# Altium schematic sheet USB_HUB2 DN PORT.SchDoc: USB_HUB 3.0
size A2; DrawnBy: Luca Schenetti; Revision: A; SheetNumber: 8; SheetTotal: 10
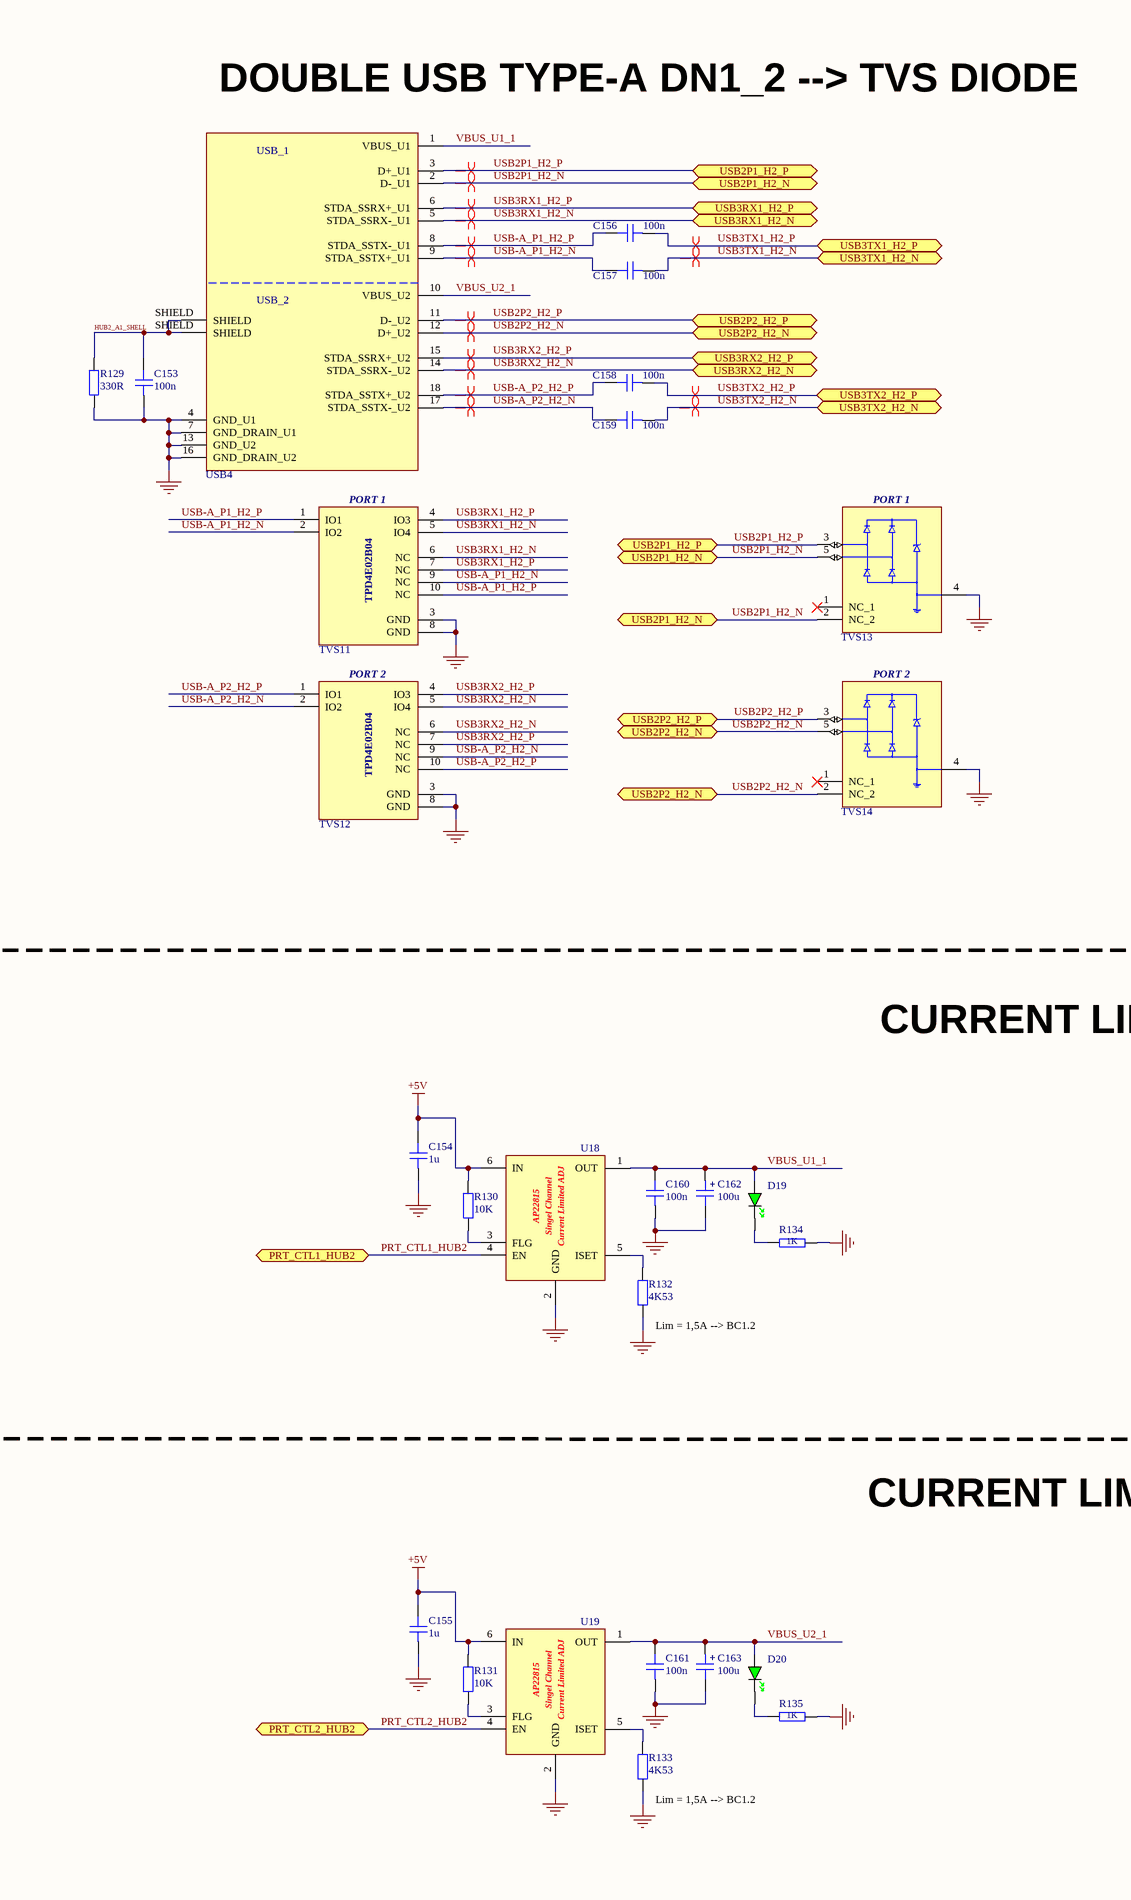
[diagram p0: USB_HUB2 DN PORT.SchDoc, left]
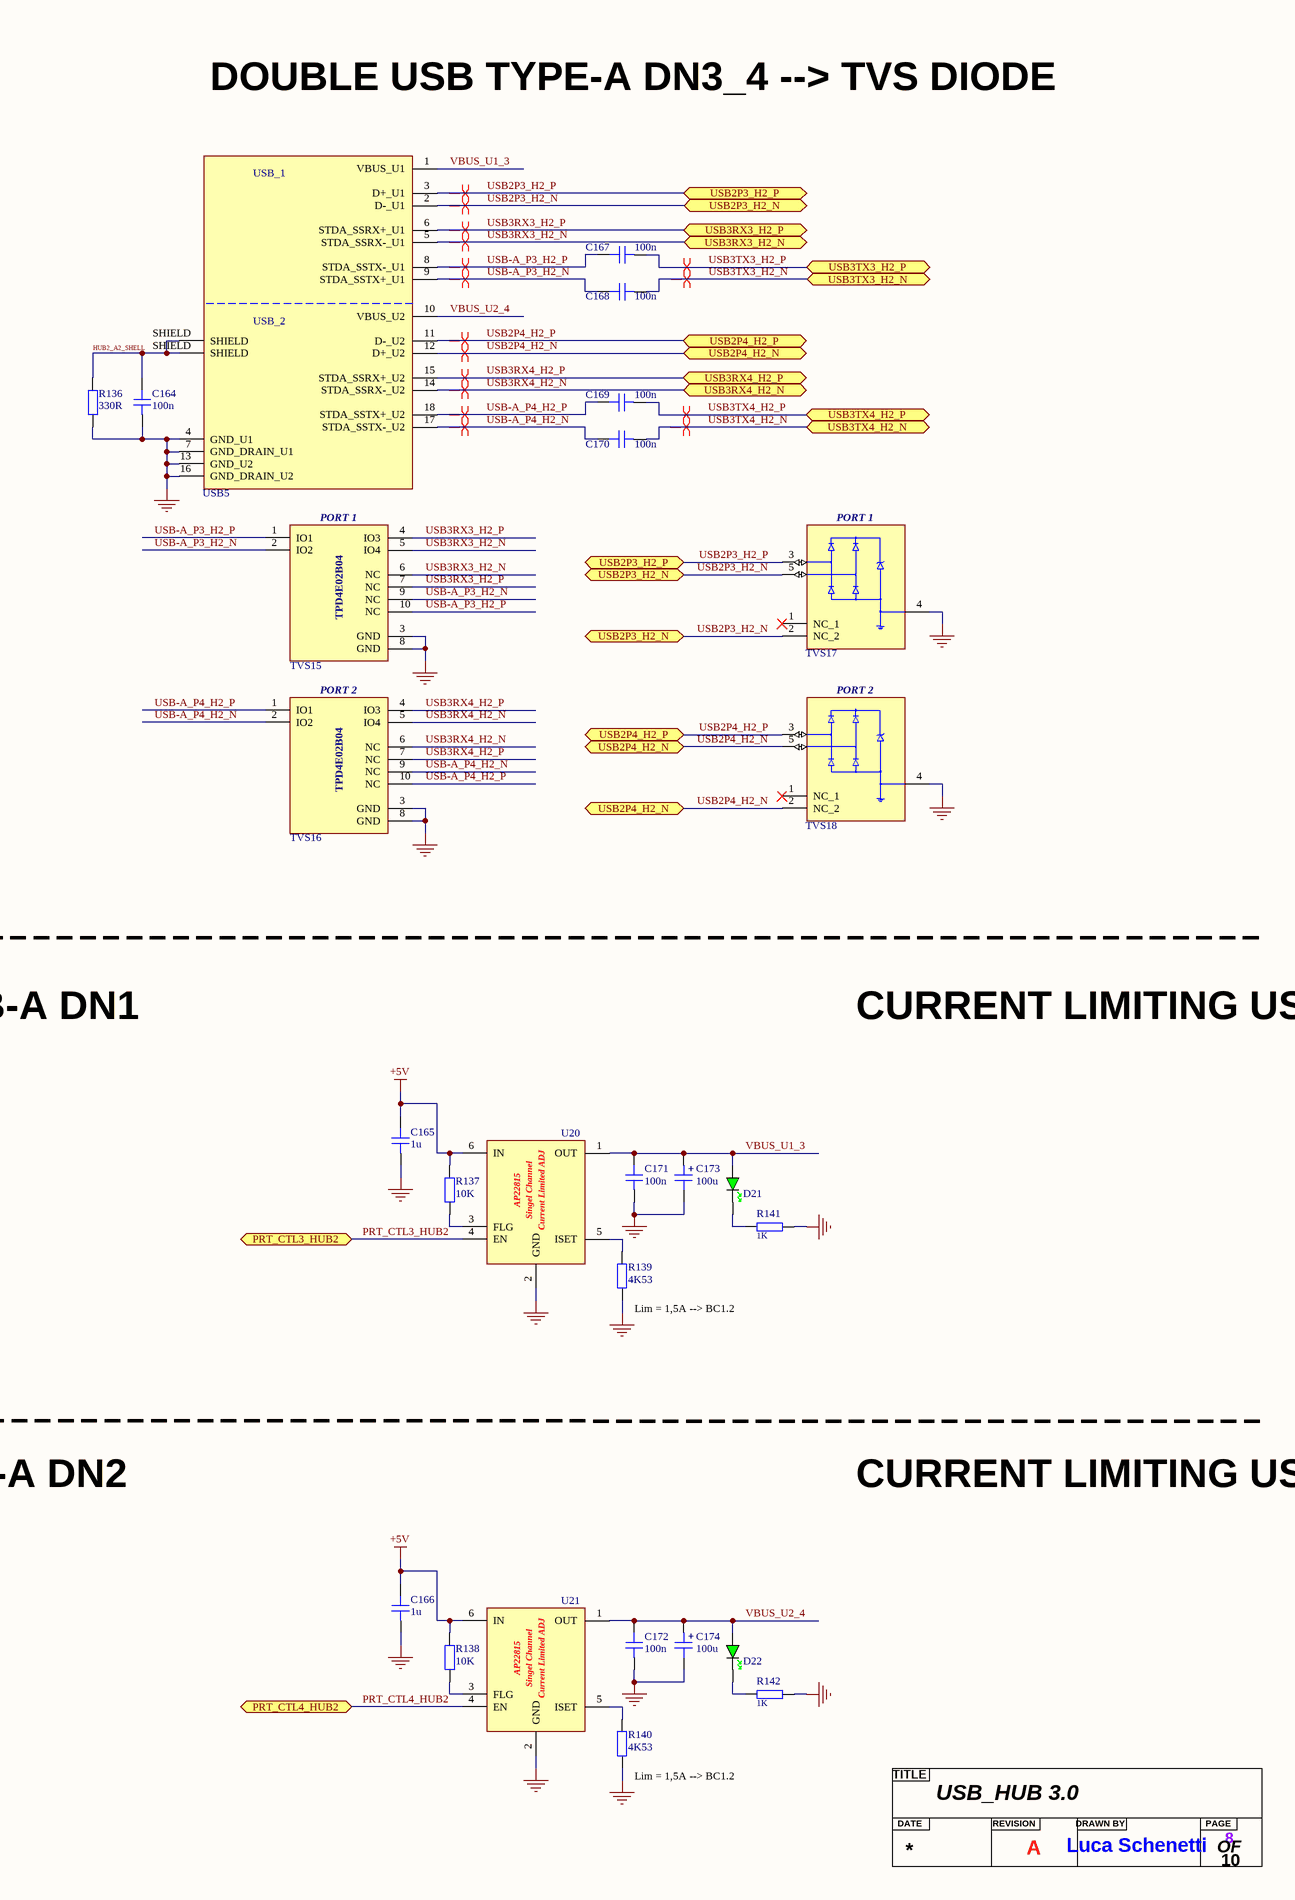
[diagram p1: USB_HUB2 DN PORT.SchDoc, right]

## Parts
?  Title  (value not drawn)  (graphical)
C153  100n  [CAP_0603]
C154  1u  [CAP_0603]
C155  1u  [CAP_0603]
C156  100n  [CAP_0402]
C157  100n  [CAP_0402]
C158  100n  [CAP_0402]
C159  100n  [CAP_0402]
C160  100n  [CAP_0603]
C161  100n  [CAP_0603]
C162  100u  [CAP_AE_SMD_D6MM3_H5M55]
C163  100u  [CAP_AE_SMD_D6MM3_H5M55]
C164  100n  [CAP_0603]
C165  1u  [CAP_0603]
C166  1u  [CAP_0603]
C167  100n  [CAP_0402]
C168  100n  [CAP_0402]
C169  100n  [CAP_0402]
C170  100n  [CAP_0402]
C171  100n  [CAP_0603]
C172  100n  [CAP_0603]
C173  100u  [CAP_AE_SMD_D6MM3_H5M55]
C174  100u  [CAP_AE_SMD_D6MM3_H5M55]
D19  GREEN  [LED_0603_GREEN]  (value not drawn)
D20  GREEN  [LED_0603_GREEN]  (value not drawn)
D21  GREEN  [LED_0603_GREEN]  (value not drawn)
D22  GREEN  [LED_0603_GREEN]  (value not drawn)
R129  330R  [RES_0603]
R130  10K  [RES_0603]
R131  10K  [RES_0603]
R132  4K53  [RES_0603]
R133  4K53  [RES_0603]
R134  1K  [RES_0603]
R135  1K  [RES_0603]
R136  330R  [RES_0603]
R137  10K  [RES_0603]
R138  10K  [RES_0603]
R139  4K53  [RES_0603]
R140  4K53  [RES_0603]
R141  1K  [RES_0603]
R142  1K  [RES_0603]
TVS11  TVS DIODE USB 3  [TPD4E02B04DQAR]  (value not drawn)
TVS12  TVS DIODE USB 3  [TPD4E02B04DQAR]  (value not drawn)
TVS13  TVS USB 2.0 ±25-kV  [TPD2E2U06DRLR]  (value not drawn)
TVS14  TVS USB 2.0 ±25-kV  [TPD2E2U06DRLR]  (value not drawn)
TVS15  TVS DIODE USB 3  [TPD4E02B04DQAR]  (value not drawn)
TVS16  TVS DIODE USB 3  [TPD4E02B04DQAR]  (value not drawn)
TVS17  TVS USB 2.0 ±25-kV  [TPD2E2U06DRLR]  (value not drawn)
TVS18  TVS USB 2.0 ±25-kV  [TPD2E2U06DRLR]  (value not drawn)
U18  Single-Channel, Current-Limited,ISET  [AP22615AWU-7]  (value not drawn)
U19  Single-Channel, Current-Limited,ISET  [AP22615AWU-7]  (value not drawn)
U20  Single-Channel, Current-Limited,ISET  [AP22615AWU-7]  (value not drawn)
U21  Single-Channel, Current-Limited,ISET  [AP22615AWU-7]  (value not drawn)
USB4  DOUBLE TYPE-A 3.0  [ZX-TYPEA-3-WCM99]  (value not drawn)
USB5  DOUBLE TYPE-A 3.0  [ZX-TYPEA-3-WCM99]  (value not drawn)

## Ports
PRT_CTL1_HUB2 (bidir, see USB_HUB1 DN PORT 3[2C]), PRT_CTL2_HUB2 (bidir, see USB_HUB1 DN PORT 3[2C]), PRT_CTL3_HUB2 (bidir, see USB_HUB1 DN PORT 3[2C]), PRT_CTL4_HUB2 (bidir, see USB_HUB1 DN PORT 3[2C]), USB2P1_H2_N (bidir, see USB_HUB1 DN PORT 3[4B], USB_HUB2 DN PORT[3A], USB_HUB2 DN PORT[3B]), USB2P1_H2_N (bidir, see USB_HUB1 DN PORT 3[4B], USB_HUB2 DN PORT[3B]), USB2P1_H2_P (bidir, see USB_HUB1 DN PORT 3[4B], USB_HUB2 DN PORT[3A]), USB2P1_H2_P (bidir, see USB_HUB1 DN PORT 3[4B], USB_HUB2 DN PORT[3B]), USB2P2_H2_N (bidir, see USB_HUB1 DN PORT 3[4C], USB_HUB2 DN PORT[3A], USB_HUB2 DN PORT[3B]), USB2P2_H2_N (bidir, see USB_HUB1 DN PORT 3[4C], USB_HUB2 DN PORT[3B]), USB2P2_H2_P (bidir, see USB_HUB1 DN PORT 3[4C], USB_HUB2 DN PORT[3A]), USB2P2_H2_P (bidir, see USB_HUB1 DN PORT 3[4C], USB_HUB2 DN PORT[3B]), USB2P3_H2_N (bidir, see USB_HUB1 DN PORT 3[4C], USB_HUB2 DN PORT[6B]), USB2P3_H2_N (bidir, see USB_HUB1 DN PORT 3[4C], USB_HUB2 DN PORT[6B], USB_HUB2 DN PORT[7A]), USB2P3_H2_P (bidir, see USB_HUB1 DN PORT 3[4C], USB_HUB2 DN PORT[6B]), USB2P3_H2_P (bidir, see USB_HUB1 DN PORT 3[4C], USB_HUB2 DN PORT[7A]), USB2P4_H2_N (bidir, see USB_HUB1 DN PORT 3[4C], USB_HUB2 DN PORT[6B]), USB2P4_H2_N (bidir, see USB_HUB1 DN PORT 3[4C], USB_HUB2 DN PORT[6B], USB_HUB2 DN PORT[7A]), USB2P4_H2_P (bidir, see USB_HUB1 DN PORT 3[4C], USB_HUB2 DN PORT[6B]), USB2P4_H2_P (bidir, see USB_HUB1 DN PORT 3[4C], USB_HUB2 DN PORT[7A]), USB3RX1_H2_N (bidir, see USB_HUB1 DN PORT 3[4B]), USB3RX1_H2_P (bidir, see USB_HUB1 DN PORT 3[4B]), USB3RX2_H2_N (bidir, see USB_HUB1 DN PORT 3[4C]), USB3RX2_H2_P (bidir, see USB_HUB1 DN PORT 3[4C]), USB3RX3_H2_N (bidir, see USB_HUB1 DN PORT 3[4C]), USB3RX3_H2_P (bidir, see USB_HUB1 DN PORT 3[4C]), USB3RX4_H2_N (bidir, see USB_HUB1 DN PORT 3[4C]), USB3RX4_H2_P (bidir, see USB_HUB1 DN PORT 3[4C]), USB3TX1_H2_N (bidir, see USB_HUB1 DN PORT 3[4C]), USB3TX1_H2_P (bidir, see USB_HUB1 DN PORT 3[4C]), USB3TX2_H2_N (bidir, see USB_HUB1 DN PORT 3[4C]), USB3TX2_H2_P (bidir, see USB_HUB1 DN PORT 3[4C]), USB3TX3_H2_N (bidir, see USB_HUB1 DN PORT 3[4C]), USB3TX3_H2_P (bidir, see USB_HUB1 DN PORT 3[4C]), USB3TX4_H2_N (bidir, see USB_HUB1 DN PORT 3[4C]), USB3TX4_H2_P (bidir, see USB_HUB1 DN PORT 3[4C])

## Nets
+5V: C154.2 C155.2 C165.2 C166.2 R130.2 R131.2 R137.2 R138.2 U18.6(IN) U19.6(IN) U20.6(IN) U21.6(IN)
GND: C153.1 C154.1 C155.1 C160.1 C161.1 C162.2 C163.2 C164.1 C165.1 C166.1 C171.1 C172.1 C173.2 C174.2 R129.1 R132.1 R133.1 R134.2 R135.2 R136.1 R139.1 R140.1 R141.2 R142.2 TVS11.3(GND) TVS11.8(GND) TVS12.3(GND) TVS12.8(GND) TVS13.4(GND) TVS14.4(GND) TVS15.3(GND) TVS15.8(GND) TVS16.3(GND) TVS16.8(GND) TVS17.4(GND) TVS18.4(GND) U18.2(GND) U19.2(GND) U20.2(GND) U21.2(GND) USB4.4(GND_U1) USB4.7(GND_DRAIN_U1) USB4.13(GND_U2) USB4.16(GND_DRAIN_U2) USB5.4(GND_U1) USB5.7(GND_DRAIN_U1) USB5.13(GND_U2) USB5.16(GND_DRAIN_U2)
HUB2_A1_SHELL: C153.2 R129.2 USB4.SHIELD
HUB2_A2_SHELL: C164.2 R136.2 USB5.SHIELD
PRT_CTL1_HUB2: U18.4(EN) ; port PRT_CTL1_HUB2
PRT_CTL2_HUB2: U19.4(EN) ; port PRT_CTL2_HUB2
PRT_CTL3_HUB2: U20.4(EN) ; port PRT_CTL3_HUB2
PRT_CTL4_HUB2: U21.4(EN) ; port PRT_CTL4_HUB2
USB2P1_H2_N: TVS13.2(NC_2) TVS13.5(IO2) USB4.2(D-_U1) ; port USB2P1_H2_N
USB2P1_H2_P: TVS13.3(IO1) USB4.3(D+_U1) ; port USB2P1_H2_P
USB2P2_H2_N: TVS14.2(NC_2) TVS14.5(IO2) USB4.12(D+_U2) ; port USB2P2_H2_N
USB2P2_H2_P: TVS14.3(IO1) USB4.11(D-_U2) ; port USB2P2_H2_P
USB2P3_H2_N: TVS17.2(NC_2) TVS17.5(IO2) USB5.2(D-_U1) ; port USB2P3_H2_N
USB2P3_H2_P: TVS17.3(IO1) USB5.3(D+_U1) ; port USB2P3_H2_P
USB2P4_H2_N: TVS18.2(NC_2) TVS18.5(IO2) USB5.12(D+_U2) ; port USB2P4_H2_N
USB2P4_H2_P: TVS18.3(IO1) USB5.11(D-_U2) ; port USB2P4_H2_P
USB3RX1_H2_N: TVS11.5(IO4) TVS11.6(NC) USB4.5(STDA_SSRX-_U1) ; port USB3RX1_H2_N
USB3RX1_H2_P: TVS11.4(IO3) TVS11.7(NC) USB4.6(STDA_SSRX+_U1) ; port USB3RX1_H2_P
USB3RX2_H2_N: TVS12.5(IO4) TVS12.6(NC) USB4.14(STDA_SSRX-_U2) ; port USB3RX2_H2_N
USB3RX2_H2_P: TVS12.4(IO3) TVS12.7(NC) USB4.15(STDA_SSRX+_U2) ; port USB3RX2_H2_P
USB3RX3_H2_N: TVS15.5(IO4) TVS15.6(NC) USB5.5(STDA_SSRX-_U1) ; port USB3RX3_H2_N
USB3RX3_H2_P: TVS15.4(IO3) TVS15.7(NC) USB5.6(STDA_SSRX+_U1) ; port USB3RX3_H2_P
USB3RX4_H2_N: TVS16.5(IO4) TVS16.6(NC) USB5.14(STDA_SSRX-_U2) ; port USB3RX4_H2_N
USB3RX4_H2_P: TVS16.4(IO3) TVS16.7(NC) USB5.15(STDA_SSRX+_U2) ; port USB3RX4_H2_P
USB3TX1_H2_N: C157.1 ; port USB3TX1_H2_N
USB3TX1_H2_P: C156.1 ; port USB3TX1_H2_P
USB3TX2_H2_N: C159.1 ; port USB3TX2_H2_N
USB3TX2_H2_P: C158.1 ; port USB3TX2_H2_P
USB3TX3_H2_N: C168.1 ; port USB3TX3_H2_N
USB3TX3_H2_P: C167.1 ; port USB3TX3_H2_P
USB3TX4_H2_N: C170.1 ; port USB3TX4_H2_N
USB3TX4_H2_P: C169.1 ; port USB3TX4_H2_P
USB-A_P1_H2_N: C157.2 TVS11.2(IO2) TVS11.9(NC) USB4.9(STDA_SSTX+_U1)
USB-A_P1_H2_P: C156.2 TVS11.1(IO1) TVS11.10(NC) USB4.8(STDA_SSTX-_U1)
USB-A_P2_H2_N: C159.2 TVS12.2(IO2) TVS12.9(NC) USB4.17(STDA_SSTX-_U2)
USB-A_P2_H2_P: C158.2 TVS12.1(IO1) TVS12.10(NC) USB4.18(STDA_SSTX+_U2)
USB-A_P3_H2_N: C168.2 TVS15.2(IO2) TVS15.9(NC) USB5.9(STDA_SSTX+_U1)
USB-A_P3_H2_P: C167.2 TVS15.1(IO1) TVS15.10(NC) USB5.8(STDA_SSTX-_U1)
USB-A_P4_H2_N: C170.2 TVS16.2(IO2) TVS16.9(NC) USB5.17(STDA_SSTX-_U2)
USB-A_P4_H2_P: C169.2 TVS16.1(IO1) TVS16.10(NC) USB5.18(STDA_SSTX+_U2)
VBUS_U1_1: C160.2 C162.1 D19.A U18.1(OUT) USB4.1(VBUS_U1)
VBUS_U1_3: C171.2 C173.1 D21.A U20.1(OUT) USB5.1(VBUS_U1)
VBUS_U2_1: C161.2 C163.1 D20.A U19.1(OUT) USB4.10(VBUS_U2)
VBUS_U2_4: C172.2 C174.1 D22.A U21.1(OUT) USB5.10(VBUS_U2)
NetD19_K: D19.K R134.1
NetD20_K: D20.K R135.1
NetD21_K: D21.K R141.1
NetD22_K: D22.K R142.1
NetR130_1: R130.1 U18.3(FLG)
NetR131_1: R131.1 U19.3(FLG)
NetR132_2: R132.2 U18.5(ISET)
NetR133_2: R133.2 U19.5(ISET)
NetR137_1: R137.1 U20.3(FLG)
NetR138_1: R138.1 U21.3(FLG)
NetR139_2: R139.2 U20.5(ISET)
NetR140_2: R140.2 U21.5(ISET)

Not connected (* = marked no-connect by the designer): TVS13 1(NC_1)*; TVS14 1(NC_1)*; TVS17 1(NC_1)*; TVS18 1(NC_1)*

## Layout directives
differential pair; differential pair class DIFF_USB_90Ω: USB2P1_H2_N, USB2P1_H2_P, USB2P2_H2_N, USB2P2_H2_P, USB2P3_H2_N, USB2P3_H2_P, USB2P4_H2_N, USB2P4_H2_P, USB3RX1_H2_N, USB3RX1_H2_P, USB3RX2_H2_N, USB3RX2_H2_P, USB3RX3_H2_N, USB3RX3_H2_P, USB3RX4_H2_N, USB3RX4_H2_P, USB3TX1_H2_N, USB3TX1_H2_P, USB3TX2_H2_N, USB3TX2_H2_P, USB3TX3_H2_N, USB3TX3_H2_P, USB3TX4_H2_N, USB3TX4_H2_P, USB-A_P1_H2_N, USB-A_P1_H2_P, USB-A_P2_H2_N, USB-A_P2_H2_P, USB-A_P3_H2_N, USB-A_P3_H2_P, USB-A_P4_H2_N, USB-A_P4_H2_P

## Notes on the sheet
- (near USB4) DOUBLE USB TYPE-A DN1_2 --> TVS DIODE
- DOUBLE USB TYPE-A DN3_4 --> TVS DIODE
- (near TVS11) PORT 1
- (near TVS13) PORT 1
- (near TVS15) PORT 1
- (near TVS17) PORT 1
- (near TVS12) PORT 2
- PORT 2
- (near TVS16) PORT 2
- CURRENT LIMITING USB-A DN1
- CURRENT LIMITING USB-A DN3
- (near R132) Lim = 1,5A --> BC1.2
- (near R139) Lim = 1,5A --> BC1.2
- CURRENT LIMITING USB-A DN2
- CURRENT LIMITING USB-A DN4
- (near R133) Lim = 1,5A --> BC1.2
- (near R140) Lim = 1,5A --> BC1.2
- (in symbol AP22615AWU-7) AP22815; Singel Channel; Current Limited ADJ
- (in symbol CAP_ALEL_6.3x5.5) +
- (in symbol Title) TITLE; DATE; REVISION; DRAWN BY; PAGE; OF
- (in symbol TPD4E02B04DQAR) TPD4E02B04
- (in symbol ZX-TYPEA-3-WCM99) USB_1; USB_2

## Library data of the parts
C153 C160 C161 C164 C171 C172 = CAP_0603: Capacitor SMD 0603 [C14663]; Manufacturer: *; Manufacturer Part Number: *; Distributor Link: *; LCSC: *; Rating: *; Dielectric: *
C154 C155 C165 C166 = CAP_0603: Capacitor SMD 0603 [C15849]; Manufacturer: *; Manufacturer Part Number: *; Distributor Link: *; LCSC: *; Rating: *; Dielectric: *
C156-C159 C167-C170 = CAP_0402: Capacitor SMD 0402[C1525]; Manufacturer: *; Manufacturer Part Number: *; Distributor Link: *; LCSC: *; Rating: *; Dielectric: *
C162 C163 C173 C174 = CAP_ALEL_6.3x5.5: [C59936]; Manufacturer: *; Manufacturer Part Number: *; Distributor Link: *; LCSC: *
D19-D22 = LED_0603_GREEN: [C2986059]
R129 R136 = RES_0603: [C23138]; Manufacturer: *; Manufacturer Part Number: *; Distributor Link: *; LCSC: *
R130 R131 R137 R138 = RES_0603: [C25804]; Manufacturer: *; Manufacturer Part Number: *; Distributor Link: *; LCSC: *
R132 R133 R139 R140 = RES_0603: [C25971]; Manufacturer: *; Manufacturer Part Number: *; Distributor Link: *; LCSC: *
R134 R135 R141 R142 = RES_0603: [C21190]; Manufacturer: *; Manufacturer Part Number: *; Distributor Link: *; LCSC: *
TVS11 TVS12 TVS15 TVS16 = TPD4E02B04DQAR: [C106794]
TVS13 TVS14 TVS17 TVS18 = TPD2E2U06DRLR: [C1972959]
U18-U21 = AP22615AWU-7: [C2680357]
USB4 USB5 = ZX-TYPEA-3-WCM99: [C7419883]